# Altium schematic sheet WDT_Supervisory.SchDoc
size A
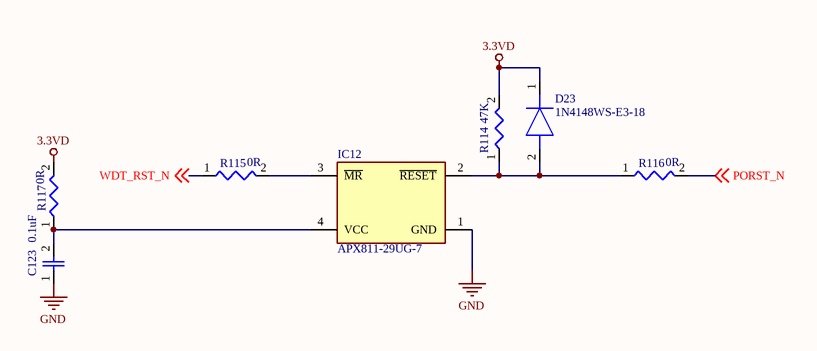
[diagram p0: WDT_Supervisory.SchDoc]

## Parts
C123  0.1uF  [0603-C]
D23  1N4148WS-E3-18  [SOD2713X115N]
IC12  APX811-29UG-7  [SOT143]
R114  47K  [0402-R]
R115  0R  [0402-R]
R116  0R  [0402-R]
R117  0R  [0402-R]

## Nets
3.3VD: D23.1(K) R114.2 R117.2
GND: C123.1 IC12.1(GND)
PORST_N: R116.2 ; off-sheet PORST_N
WDT_RST_N: R115.1 ; off-sheet WDT_RST_N
NetC123_2: C123.2 IC12.4(VCC) R117.1
NetD23_2: D23.2(A) IC12.2(~{RESET}) R114.1 R116.1
NetIC12_3: IC12.3(~{MR}) R115.2

## Library data of the parts
C123 = CAP
D23 = 1N4148WS-E3-18: Diode; Manufacturer_Name: Vishay; Datasheet Link: https://www.vishay.com/docs/85751/1n4148ws.pdf; Height: 1.15mm; Manufacturer_Part_Number: 1N4148WS-E3-18; Mouser Part Number: 78-1N4148WS-E3-18; Mouser Price/Stock: https://www.mouser.co.uk/ProductDetail/Vishay-Semiconductors/1N4148WS-E3-18?qs=bTzheeSci6SMGZleBxLU%2Fg%3D%3D; Arrow Part Number: 1N4148WS-E3-18; Arrow Price/Stock: https://www.arrow.com/en/products/1n4148ws-e3-18/vishay?region=nac
IC12 = APX811-29UG-7: Supervisory Circuits 4-Pin MPU Supervisor; Manufacturer_Name: Diodes Inc.
R114-R117 = Res